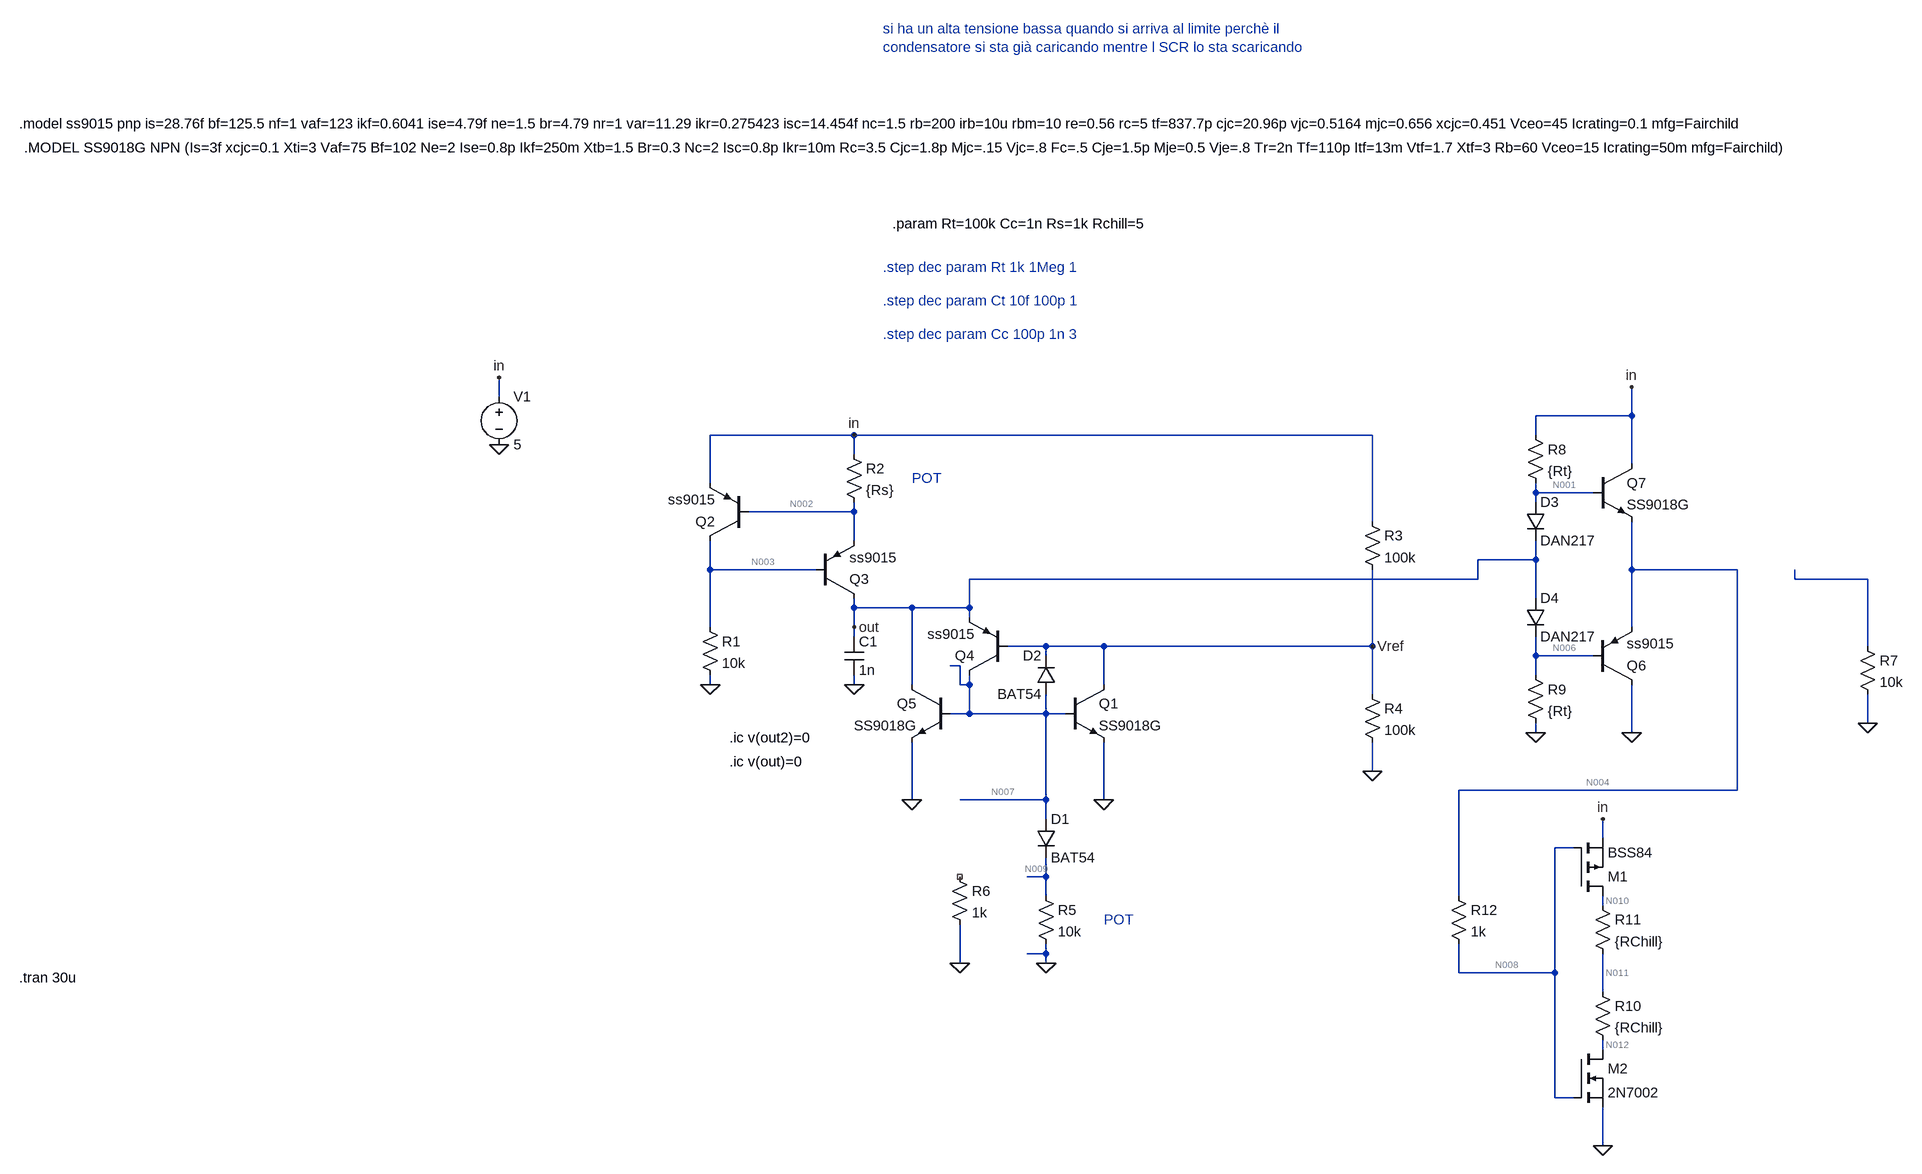
[diagram p0: schematic Sawtooth pier.asc]
Sawtooth pier.asc, the LTspice schematic file:
Version 4.1
SHEET 1 2960 1760
WIRE -320 -64 -320 -96
WIRE 1568 -32 1568 -80
WIRE 1568 -32 1408 -32
WIRE 272 0 32 0
WIRE 1136 0 272 0
WIRE 1408 0 1408 -32
WIRE 272 32 272 0
WIRE 1568 48 1568 -32
WIRE 32 80 32 0
WIRE 1408 96 1408 80
WIRE 1504 96 1408 96
WIRE 1408 112 1408 96
WIRE 272 128 272 112
WIRE 272 128 96 128
WIRE 1136 144 1136 0
WIRE 272 176 272 128
WIRE 1408 208 1408 176
WIRE 1408 208 1312 208
WIRE 32 224 32 176
WIRE 208 224 32 224
WIRE 1568 224 1568 144
WIRE 1744 224 1568 224
WIRE 1312 240 1312 208
WIRE 1312 240 464 240
WIRE 1840 240 1840 224
WIRE 2160 240 1840 240
WIRE 1408 272 1408 208
WIRE 272 288 272 272
WIRE 368 288 272 288
WIRE 464 288 464 240
WIRE 464 288 368 288
WIRE 464 304 464 288
WIRE 32 320 32 224
WIRE 272 320 272 288
WIRE 1568 320 1568 224
WIRE 272 336 272 320
WIRE 592 352 528 352
WIRE 688 352 592 352
WIRE 1136 352 1136 224
WIRE 1136 352 688 352
WIRE 2160 352 2160 240
WIRE 592 368 592 352
WIRE 1408 368 1408 336
WIRE 1504 368 1408 368
WIRE 448 384 432 384
WIRE 1408 400 1408 368
WIRE 32 416 32 400
WIRE 272 416 272 400
WIRE 368 416 368 288
WIRE 448 416 448 384
WIRE 464 416 464 400
WIRE 464 416 448 416
WIRE 688 416 688 352
WIRE 1136 432 1136 352
WIRE 464 464 464 416
WIRE 464 464 432 464
WIRE 592 464 592 432
WIRE 592 464 464 464
WIRE 624 464 592 464
WIRE 2160 480 2160 432
WIRE 1408 496 1408 480
WIRE 1568 496 1568 416
WIRE 1136 560 1136 512
WIRE 1744 592 1744 224
WIRE 1744 592 1280 592
WIRE 368 608 368 512
WIRE 592 608 592 464
WIRE 592 608 448 608
WIRE 688 608 688 512
WIRE 592 640 592 608
WIRE 1520 672 1520 640
WIRE 1472 688 1440 688
WIRE 592 736 592 704
WIRE 592 736 560 736
WIRE 592 768 592 736
WIRE 1280 768 1280 592
WIRE 1520 784 1520 768
WIRE 592 864 592 848
WIRE 592 864 560 864
WIRE 448 880 448 816
WIRE 592 880 592 864
WIRE 1280 896 1280 848
WIRE 1440 896 1440 688
WIRE 1440 896 1280 896
WIRE 1520 928 1520 864
WIRE 1520 1024 1520 1008
WIRE 1440 1104 1440 896
WIRE 1472 1104 1440 1104
WIRE 1520 1184 1520 1120
FLAG -320 16 0
FLAG -320 -96 in
FLAG 32 416 0
FLAG 272 416 0
FLAG 1136 560 0
FLAG 688 608 0
FLAG 272 320 out
FLAG 368 608 0
FLAG 272 0 in
FLAG 592 880 0
FLAG 1136 352 Vref
FLAG 448 880 0
FLAG 1568 -80 in
FLAG 1568 496 0
FLAG 2160 480 0
FLAG 1408 496 0
FLAG 1520 1184 0
FLAG 1520 640 in
SYMBOL voltage -320 -80 R0
WINDOW 123 0 0 Left 0
WINDOW 39 0 0 Left 0
SYMATTR InstName V1
SYMATTR Value 5
SYMBOL res 16 304 R0
SYMATTR InstName R1
SYMATTR Value 10k
SYMBOL res 256 16 R0
SYMATTR InstName R2
SYMATTR Value {Rs}
SYMBOL cap 256 336 R0
SYMATTR InstName C1
SYMATTR Value 1n
SYMBOL res 1120 128 R0
SYMATTR InstName R3
SYMATTR Value 100k
SYMBOL res 1120 416 R0
SYMATTR InstName R4
SYMATTR Value 100k
SYMBOL npn 624 416 R0
SYMATTR InstName Q1
SYMATTR Value SS9018G
SYMBOL pnp 96 176 R180
SYMATTR InstName Q2
SYMATTR Value ss9015
SYMBOL res 576 752 R0
SYMATTR InstName R5
SYMATTR Value 10k
SYMBOL diode 576 640 R0
SYMATTR InstName D1
SYMATTR Value BAT54
SYMBOL res 432 720 R0
SYMATTR InstName R6
SYMATTR Value 1k
SYMBOL diode 608 432 R180
WINDOW 0 24 64 Left 2
WINDOW 3 24 0 Left 2
SYMATTR InstName D2
SYMATTR Value BAT54
SYMBOL pnp 208 272 M180
SYMATTR InstName Q3
SYMATTR Value ss9015
SYMBOL pnp 528 400 R180
SYMATTR InstName Q4
SYMATTR Value ss9015
SYMBOL npn 432 416 M0
SYMATTR InstName Q5
SYMATTR Value SS9018G
SYMBOL pnp 1504 416 M180
SYMATTR InstName Q6
SYMATTR Value ss9015
SYMBOL npn 1504 48 R0
SYMATTR InstName Q7
SYMATTR Value SS9018G
SYMBOL res 2144 336 R0
SYMATTR InstName R7
SYMATTR Value 10k
SYMBOL diode 1392 112 R0
SYMATTR InstName D3
SYMATTR Value DAN217
SYMBOL diode 1392 272 R0
SYMATTR InstName D4
SYMATTR Value DAN217
SYMBOL res 1392 -16 R0
SYMATTR InstName R8
SYMATTR Value {Rt}
SYMBOL res 1392 384 R0
SYMATTR InstName R9
SYMATTR Value {Rt}
SYMBOL res 1504 912 R0
SYMATTR InstName R10
SYMATTR Value {RChill}
SYMBOL res 1504 768 R0
SYMATTR InstName R11
SYMATTR Value {RChill}
SYMBOL pmos 1472 768 M180
SYMATTR InstName M1
SYMATTR Value BSS84
SYMBOL nmos 1472 1024 R0
SYMATTR InstName M2
SYMATTR Value 2N7002
SYMBOL res 1264 752 R0
SYMATTR InstName R12
SYMATTR Value 1k
TEXT 320 -280 Left 2 ;.step dec param Rt 1k 1Meg 1
TEXT 336 -352 Left 2 !.param Rt=100k Cc=1n Rs=1k Rchill=5
TEXT 320 -224 Left 2 ;.step dec param Ct 10f 100p 1
TEXT -1120 -552 Left 2 !.model ss9015 pnp is=28.76f bf=125.5 nf=1 vaf=123 ikf=0.6041 ise=4.79f ne=1.5 br=4.79 nr=1 var=11.29 ikr=0.275423 isc=14.454f nc=1.5 rb=200 irb=10u rbm=10 re=0.56 rc=5 tf=837.7p cjc=20.96p vjc=0.5164 mjc=0.656 xcjc=0.451 Vceo=45 Icrating=0.1 mfg=Fairchild
TEXT -1112 -512 Left 2 !.MODEL SS9018G NPN (Is=3f xcjc=0.1 Xti=3 Vaf=75 Bf=102 Ne=2 Ise=0.8p Ikf=250m Xtb=1.5 Br=0.3 Nc=2 Isc=0.8p Ikr=10m Rc=3.5 Cjc=1.8p Mjc=.15 Vjc=.8 Fc=.5 Cje=1.5p Mje=0.5 Vje=.8 Tr=2n Tf=110p Itf=13m Vtf=1.7 Xtf=3 Rb=60 Vceo=15 Icrating=50m mfg=Fairchild)
TEXT 320 -776 Left 2 ;si ha un alta tensione bassa quando si arriva al limite perchè il\ncondensatore si sta già caricando mentre l SCR lo sta scaricando
TEXT 320 -168 Left 2 ;.step dec param Cc 100p 1n 3
TEXT 64 504 Left 2 !.ic v(out2)=0
TEXT 368 72 Left 2 ;POT
TEXT 688 808 Left 2 ;POT
TEXT -1120 904 Left 2 !.tran 30u
TEXT 64 544 Left 2 !.ic v(out)=0

The netlist it stands for:
* Sawtooth pier.asc
V1 in 0 5
R1 N003 0 10k
R2 in N002 {Rs}
C1 out 0 1n
R3 in Vref 100k
R4 Vref 0 100k
Q1 Vref N007 0 0 SS9018G
Q2 N003 N002 in 0 ss9015
R5 N009 0 10k
D1 N007 N009 BAT54
R6 NC_01 0 1k
D2 N007 Vref BAT54
Q3 out N003 N002 0 ss9015
Q4 N007 Vref out 0 ss9015
Q5 out N007 0 0 SS9018G
Q6 0 N006 N004 0 ss9015
Q7 in N001 N004 0 SS9018G
R7 N005 0 10k
D3 N001 out DAN217
D4 out N006 DAN217
R8 in N001 {Rt}
R9 N006 0 {Rt}
R10 N011 N012 {RChill}
R11 N010 N011 {RChill}
M1 N010 N008 in in BSS84
M2 N012 N008 0 0 2N7002
R12 N004 N008 1k
.model D D
.lib standard.dio
.model NPN NPN
.model PNP PNP
.lib standard.bjt
.model NMOS NMOS
.model PMOS PMOS
.lib standard.mos
* .step dec param Rt 1k 1Meg 1
.param Rt=100k Cc=1n Rs=1k Rchill=5
* .step dec param Ct 10f 100p 1
.model ss9015 pnp is=28.76f bf=125.5 nf=1 vaf=123 ikf=0.6041 ise=4.79f ne=1.5 br=4.79 nr=1 var=11.29 ikr=0.275423 isc=14.454f nc=1.5 rb=200 irb=10u rbm=10 re=0.56 rc=5 tf=837.7p cjc=20.96p vjc=0.5164 mjc=0.656 xcjc=0.451 Vceo=45 Icrating=0.1 mfg=Fairchild
.MODEL SS9018G NPN (Is=3f xcjc=0.1 Xti=3 Vaf=75 Bf=102 Ne=2 Ise=0.8p Ikf=250m Xtb=1.5 Br=0.3 Nc=2 Isc=0.8p Ikr=10m Rc=3.5 Cjc=1.8p Mjc=.15 Vjc=.8 Fc=.5 Cje=1.5p Mje=0.5 Vje=.8 Tr=2n Tf=110p Itf=13m Vtf=1.7 Xtf=3 Rb=60 Vceo=15 Icrating=50m mfg=Fairchild)
* si ha un alta tensione bassa quando si arriva al limite perchè il
* condensatore si sta già caricando mentre l SCR lo sta scaricando
* .step dec param Cc 100p 1n 3
.ic v(out2)=0
* POT
* POT
.tran 30u
.ic v(out)=0
.backanno
.end

* Results of the author's LTspice run, read from the files saved beside the schematic
* Operating Point, zero values left out:
*   V(in) = 5 V
*   V(n001) = 476.3 mV
*   V(n002) = 4.396 V
*   V(n003) = 3.779 V
*   V(n004) = 223.4 mV
*   V(n006) = 301.3 nV
*   V(n007) = 18.93 mV
*   V(n008) = 223.4 mV
*   V(n009) = 1 mV
*   V(n010) = 5 V
*   V(n011) = 5 V
*   V(n012) = 5 V
*   V(vref) = 2.495 V
*   I(D1) = 100 nA
*   I(D2) = -100 nA
*   I(D3) = 45.24 µA
*   I(R1) = 377.9 µA
*   I(R10) = 10.04 pA
*   I(R11) = 10.04 pA
*   I(R2) = 604.2 µA
*   I(R3) = 25.05 µA
*   I(R4) = 24.95 µA
*   I(R5) = 100 nA
*   I(R8) = 45.24 µA
*   I(R9) = 3.013 pA
*   I(V1) = -1.051 mA
*   Ib(Q1) = -2.914 pA
*   Ib(Q2) = -3.153 µA
*   Ib(Q3) = -4.959 µA
*   Ib(Q4) = 4.997 pA
*   Ib(Q6) = -3.029 pA
*   Ib(Q7) = 100.8 pA
*   Ic(Q1) = 3.293 pA
*   Ic(Q2) = -373 µA
*   Ic(Q3) = -602.4 µA
*   Ic(Q4) = -2.497 pA
*   Ic(Q6) = -159 pA
*   Ic(Q7) = 61.3 pA
*   Id(M1) = -10.04 pA
*   Id(M2) = 5.032 pA
*   Ie(Q2) = 376.1 µA
*   Ie(Q3) = 607.4 µA
*   Ie(Q4) = -2.5 pA
*   Ie(Q6) = 162.1 pA
*   Ie(Q7) = -162.1 pA
*   Is(M1) = 10.04 pA
*   Is(M2) = -5.032 pA
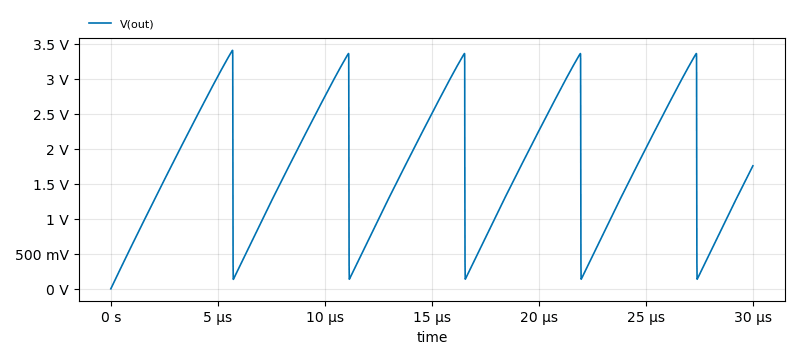
[diagram p1: Transient Analysis of Sawtooth pier.asc, plotted from the saved traces]
* Transient Analysis, 1 run:
*   V(out): min 0 V, max 3.407 V, average 1.709 V, rms 1.955 V, last 1.757 V